# Altium schematic sheet 原理图.SchDoc
size A4
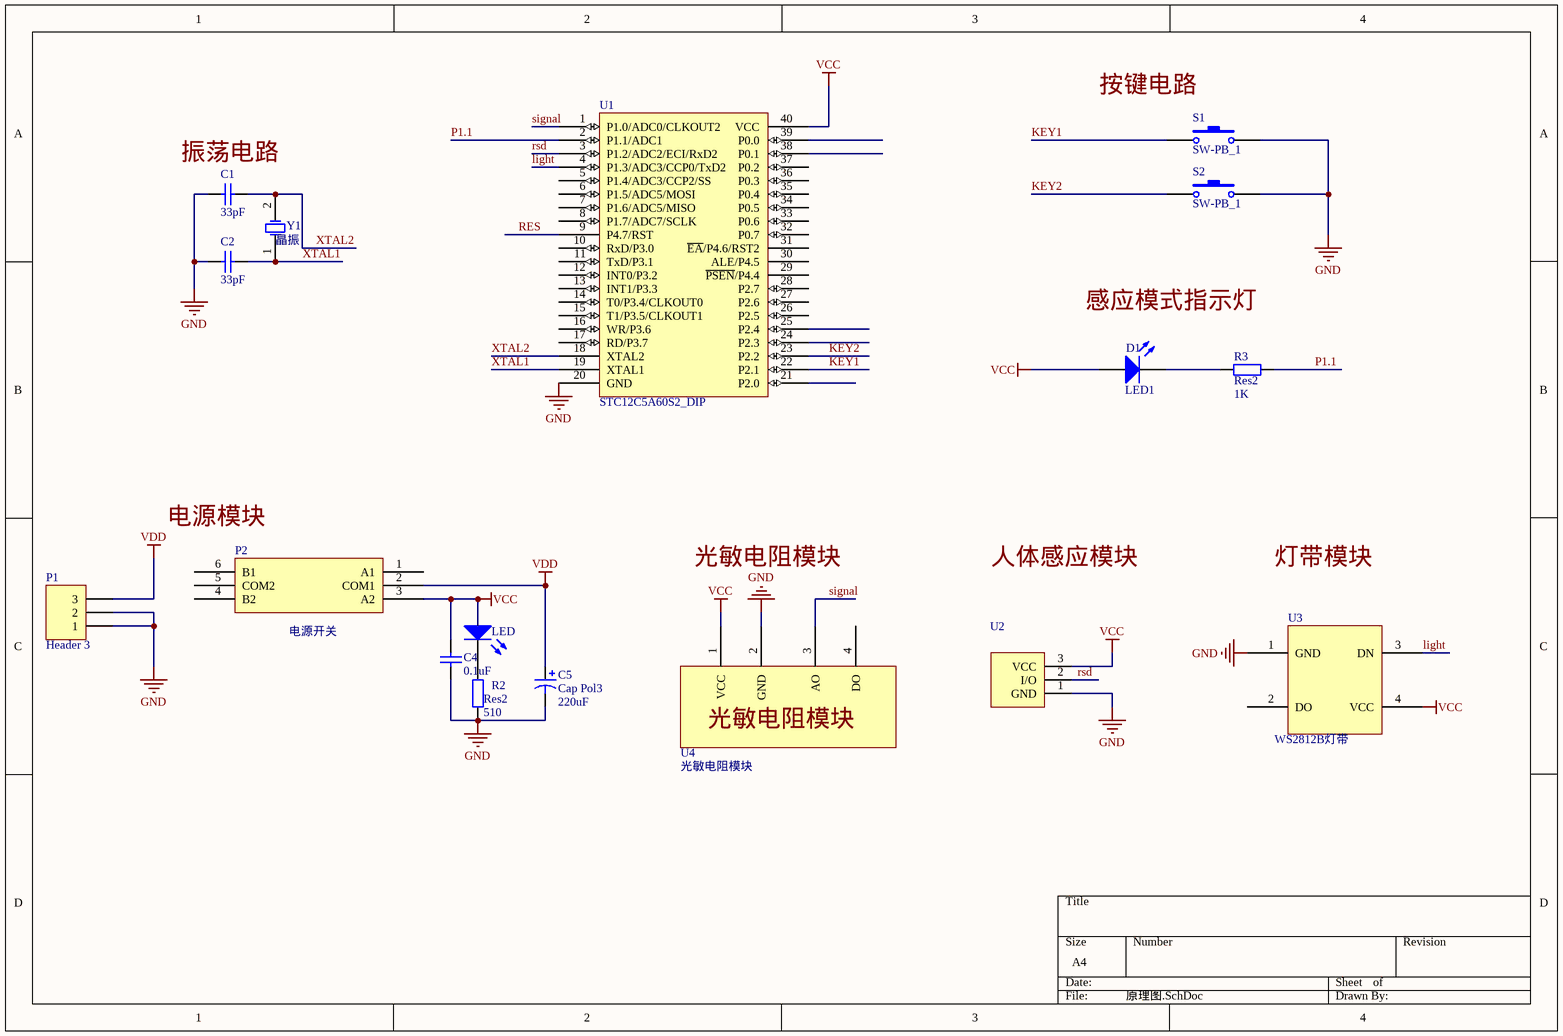
[diagram p0: 原理图.SchDoc]

## Parts
C1  value 33pF  [Capacitor-Disk-Middle]  (hidden comment: Cap Nicklon)
C2  value 33pF  [Capacitor-Disk-Middle]  (hidden comment: Cap Nicklon)
C4  value 0.1uF  [Capacitor-Disk-Middle]  (hidden comment: Cap Nicklon)
C5  Cap Pol3  value 220uF  [ED4]
D1  LED1  [CLED3216-1206]
LED  LED Chip  [CLED3216-1206]  (value not drawn)
P1  Header 3  [HT396K-3]
P2  电源开关  [HDR2X3_CEN]
R2  Res2  value 510  [AXIAL-0.4]
R3  Res2  value 1K  [AXIAL-0.4]
S1  SW-PB_1  [BUTTON_6*6]
S2  SW-PB_1  [BUTTON_6*6]
U1  STC12C5A60S2_DIP  [dip40 - 紧缩座]
U2  人体感应模块  [人体感应模块]  (value not drawn)
U3  WS2812B灯带  [灯带模块]
U4  光敏电阻模块  [光敏电阻模块]
Y1  晶振  [cry卧式]

## Nets
GND: C1.1 C2.1 C4.1 C5.2 P1.1 P1.2 R2.1 S1.2 S2.2 U1.20(GND) U2.1(GND) U3.1(GND) U4.2(GND)
VCC: C4.2 D1.1(A) LED.1(A) P2.3(A2) U1.40(VCC) U2.3(VCC) U3.4(VCC) U4.1(VCC)
VDD: C5.1 P1.3 P2.2(COM1)
KEY1: S1.1 U1.22(P2.1)
KEY2: S2.1 U1.23(P2.2)
light: U1.4(P1.3/ADC3/CCP0/TxD2) U3.3(DN)
P1.1: R3.2 U1.2(P1.1/ADC1)
RES: U1.9(P4.7/RST)
rsd: U1.3(P1.2/ADC2/ECI/RxD2) U2.2(I/O)
signal: U1.1(P1.0/ADC0/CLKOUT2) U4.3(AO)
XTAL1: C2.2 U1.19(XTAL1) Y1.1(OSC1)
XTAL2: C1.2 U1.18(XTAL2) Y1.2(OSC2)
NetD1_2: D1.2(K) R3.1
NetLED_2: LED.2(K) R2.2

Not connected (* = marked no-connect by the designer): P2 1(A1) 4(B2) 5(COM2) 6(B1); U1 5(P1.4/ADC3/CCP2/SS) 6(P1.5/ADC5/MOSI) 7(P1.6/ADC5/MISO) 8(P1.7/ADC7/SCLK) 10(RxD/P3.0) 11(TxD/P3.1) 12(INT0/P3.2) 13(INT1/P3.3) 14(T0/P3.4/CLKOUT0) 15(T1/P3.5/CLKOUT1) 16(WR/P3.6) 17(RD/P3.7) 21(P2.0) 24(P2.3) 25(P2.4) 26(P2.5) 27(P2.6) 28(P2.7) 29(~{PSEN}/P4.4) 30(ALE/P4.5) 31(~{EA}/P4.6/RST2) 32(P0.7) 33(P0.6) 34(P0.5) 35(P0.4) 36(P0.3) 37(P0.2) 38(P0.1) 39(P0.0); U3 2(DO); U4 4(DO)

## Notes on the sheet
- 按键电路
- (near C1) 振荡电路
- 感应模式指示灯
- (near P2) 电源模块
- 光敏电阻模块
- 人体感应模块
- 灯带模块

## Library data of the parts
C1 C2 C4 = Cap Nicklon: CBB聚乙烯薄膜电容; Voltage: 63V; Published: 8-Jun-2000; Revision: July-2002: Re-released for DXP Platform.; Publisher: Altium Limited; 实物样品照片: https://item.taobao.com/item.htm?spm=a230r.1.14.32.21fd24b7VWml4d&id=37914290992&ns=1&abbucket=13#detail
C5 = Cap Pol3: Polarized Capacitor (Surface Mount); Published: 8-Jun-2000; LatestRevisionDate: 29-May-2009; LatestRevisionNote: IPC-7351 Footprint Added.; PackageReference: C0805; Publisher: Altium Limited; PackageDescription: Chip Capacitor
D1 = LED0: Typical INFRARED GaAs LED; Published: 8-Jun-2000; LatestRevisionDate: 08-Jul-2005; LatestRevisionNote: Mech Layer 1 removed.; PackageReference: LED-0; Publisher: Altium Limited; PackageDescription: LED; 2 Leads
LED = LED Chip: Typical Chip LED; Published: 8-Jun-2000; Revision: July-2002: Re-released for DXP Platform.; Publisher: Altium Limited
P1 = Header 3: Header, 3-Pin; LatestRevisionDate: 17-Jul-2002; LatestRevisionNote: Re-released for DXP Platform.; Publisher: Altium Limited
R2 R3 = Res2: Resistor; Published: 8-Jun-2000; LatestRevisionDate: 17-Jul-2002; LatestRevisionNote: Re-released for DXP Platform.; PackageReference: AXIAL-0.4; Publisher: Altium Limited; PackageDescription: Axial Device, Thru-Hole; 2 Leads; 0.4 in Pin Spacing
S1 S2 = SW-PB_1: Switch; Published: 24-Mar-1999; LatestRevisionDate: 17-Jul-2002; LatestRevisionNote: Re-released for DXP Platform.; PackageReference: SPST-2; Publisher: Altium Limited
U2 = DS18B20
U3 = WS2812B
Y1 = Crystal 11.05292/12/16/24/MHz: 直插晶振11.05292/12/16/24/MHz